# EAGLE design muxed (EAGLE 7.2.0)
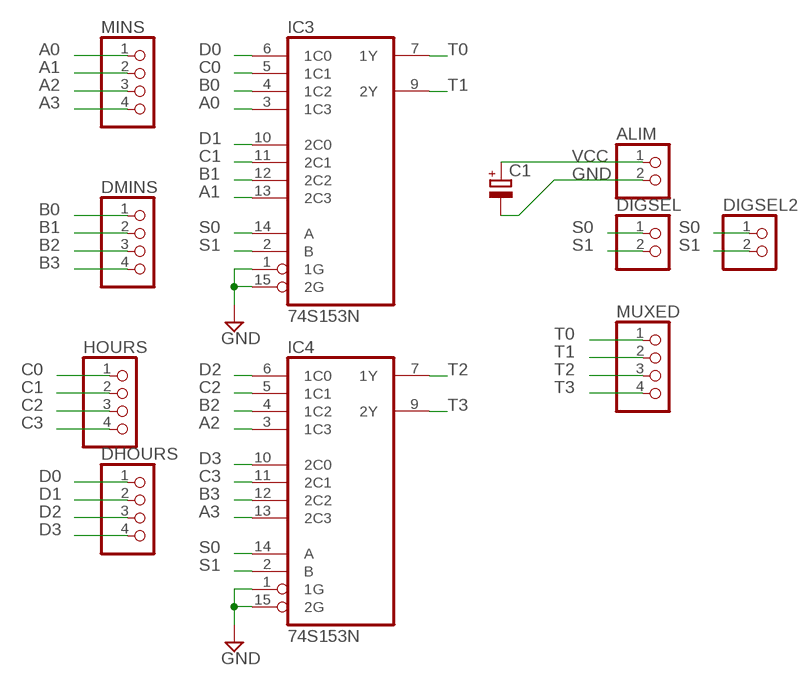
[diagram p0: schematic, sheet 1]

## Parts
ALIM  PINHD-1X2  [1X02]
C1  CPOL-EUE2-5  [E2-5]
DHOURS  PINHD-1X4  [1X04]
DIGSEL  PINHD-1X2  [1X02]
DIGSEL2  PINHD-1X2  [1X02]
DMINS  PINHD-1X4  [1X04]
HOURS  PINHD-1X4  [1X04]
IC3  74S153N  [DIL16]
IC4  74S153N  [DIL16]
MINS  PINHD-1X4  [1X04]
MUXED  PINHD-1X4  [1X04]

## Nets
A0: IC3.3(1C3) MINS.1
A1: IC3.13(2C3) MINS.2
A2: IC4.3(1C3) MINS.3
A3: IC4.13(2C3) MINS.4
B0: DMINS.1 IC3.4(1C2)
B1: DMINS.2 IC3.12(2C2)
B2: DMINS.3 IC4.4(1C2)
B3: DMINS.4 IC4.12(2C2)
C0: HOURS.1 IC3.5(1C1)
C1: HOURS.2 IC3.11(2C1)
C2: HOURS.3 IC4.5(1C1)
C3: HOURS.4 IC4.11(2C1)
D0: DHOURS.1 IC3.6(1C0)
D1: DHOURS.2 IC3.10(2C0)
D2: DHOURS.3 IC4.6(1C0)
D3: DHOURS.4 IC4.10(2C0)
GND: ALIM.2 C1.- IC3.1(1G) IC3.15(2G) IC4.1(1G) IC4.15(2G)
S0: DIGSEL2.1 DIGSEL.1 IC3.14(A) IC4.14(A)
S1: DIGSEL2.2 DIGSEL.2 IC3.2(B) IC4.2(B)
T0: IC3.7(1Y) MUXED.1
T1: IC3.9(2Y) MUXED.2
T2: IC4.7(1Y) MUXED.3
T3: IC4.9(2Y) MUXED.4
VCC: ALIM.1 C1.+

## Power pins joined to a net without a drawn wire
GND: IC3.8(GND) IC4.8(GND)
VCC: IC3.16(VCC) IC4.16(VCC)

## Library data of the parts
ALIM DIGSEL DIGSEL2 = pinhead:PINHD-1X2: PIN HEADER
C1 = rcl:CPOL-EU: POLARIZED CAPACITOR, European symbol
DHOURS DMINS HOURS MINS MUXED = pinhead:PINHD-1X4: PIN HEADER
IC3 IC4 = 74xx-us:74*153: Dual 4-line to 1-line data SELECTOR/MULTIPLEXER

## Board
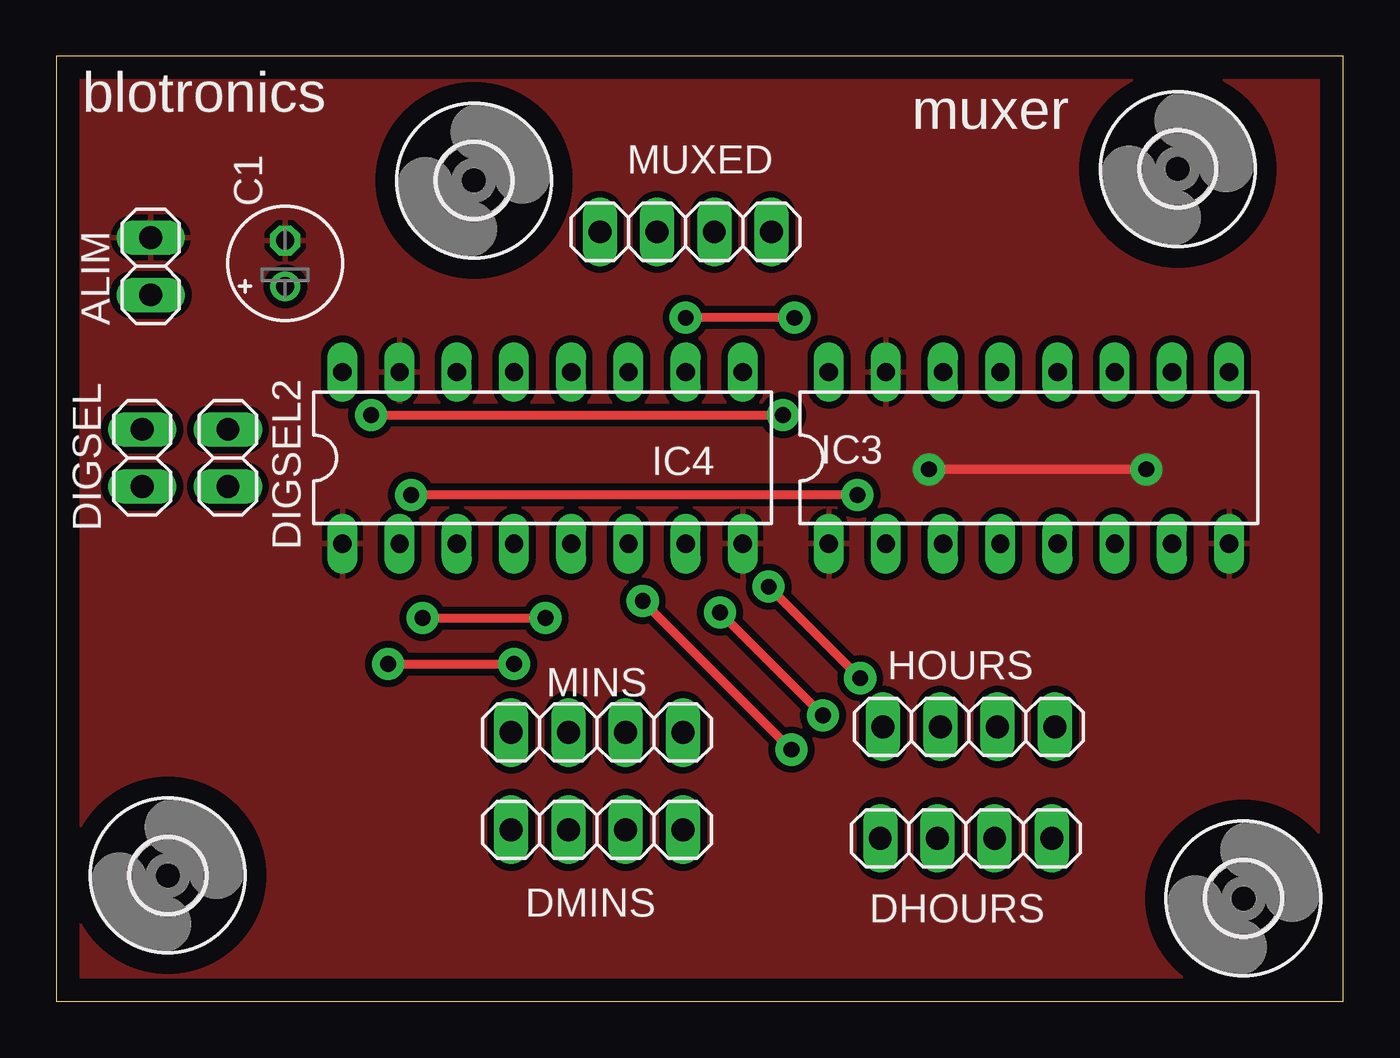
[diagram p1: board, top side]
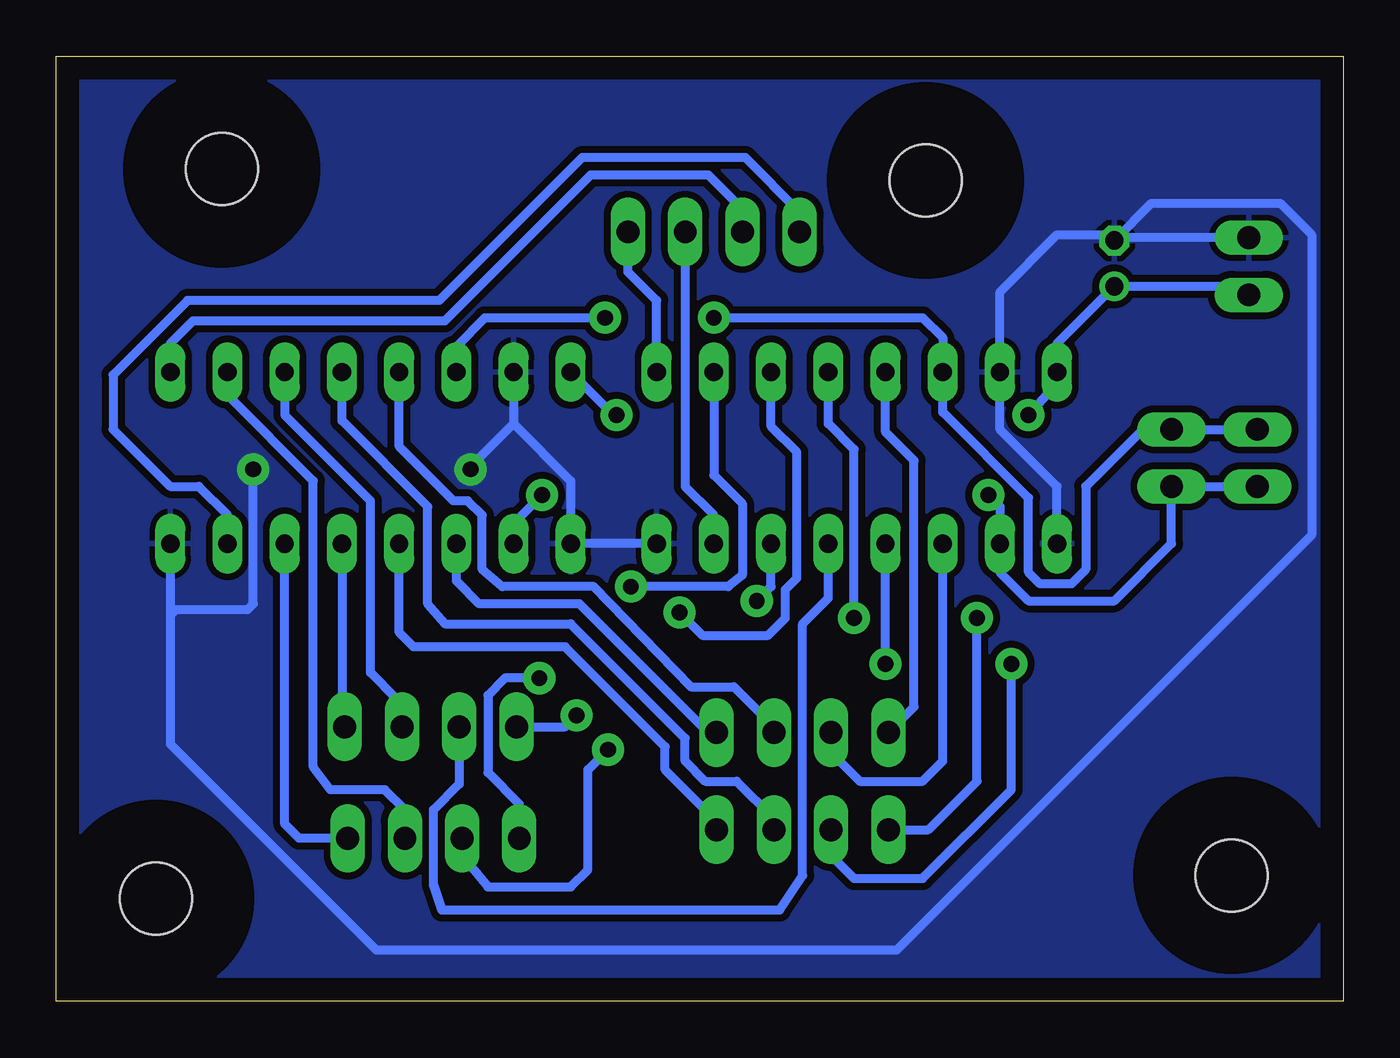
[diagram p2: board, bottom side, seen from below]

Size 57.13 x 41.96 mm. Coordinates in mm from the lower left corner, seen from the top.
Outline: 0,0 57.13,0 57.13,41.96 0,41.96 0,0
Copper layers (1*16): Top 0.035mm / dielectric 1.5mm / Bottom 0.035mm
Design rules "default": minimum track width 10mil, minimum drill 24mil, track to track 8mil, track to pad 8mil, pad to pad 8mil, via to via 8mil, smd to smd 8mil, copper to edge 40mil, drill to drill 8mil, minimum pad ring 10mil, minimum via ring 8mil, stop-mask expansion 4mil, vias tented up to drill 0mil, thermal gap 10mil

### Footprints (pad centres in the part's own frame; a part is rotated, then mirrored left to right if it is on the bottom)
1X02 = drill 1.016 long: 1 -1.27,0; 2 1.27,0
E2-5 = drill 0.813 pad 1.27: + -1.016,0 | drill 0.813 pad 1.27 octagon: - 1.016,0
1X04 = drill 1.016 long: 1 -3.81,0; 2 -1.27,0; 3 1.27,0; 4 3.81,0
DIL16 = drill 0.813 long: 1 -8.89,-3.81; 2 -6.35,-3.81; 3 -3.81,-3.81; 4 -1.27,-3.81; 5 1.27,-3.81; 6 3.81,-3.81; 7 6.35,-3.81; 8 8.89,-3.81; 9 8.89,3.81; 10 6.35,3.81; 11 3.81,3.81; 12 1.27,3.81; 13 -1.27,3.81; 14 -3.81,3.81; 15 -6.35,3.81; 16 -8.89,3.81
3,2 = hole 3.2: 0,0

### Placement (x,y rotation side)
ALIM  4.19,32.64 90 top
C1  10.16,32.77 90 top
DHOURS  40.39,7.24 180 top
DIGSEL  3.81,24.13 270 top
DIGSEL2  7.62,24.13 270 top
DMINS  24,7.62 180 top
HOURS  40.51,12.19 180 top
IC3  43.18,24.13 0 top
IC4  21.59,24.13 0 top
MINS  24,11.94 180 top
MUXED  27.94,34.16 0 top
U$1  [3,2]  18.54,36.45 0 top
U$2  [3,2]  49.78,36.96 0 top
U$3  [3,2]  4.95,5.59 0 top
U$4  [3,2]  52.7,4.57 0 top

### Tracks (layer width: path | path; a pad name or v marks a point on that pad's centre or on a via)
A0
  Bottom 0.406: IC3.3 39.37,18.67 38.35,17.65 33.91,17.65 28.19,11.94 MINS.1
A1
  Bottom 0.406: IC3.13 41.91,24.64 39.5,22.23 38.86,22.23 38.23,21.59 38.23,19.18 37.34,18.41 33.27,18.41 28.96,13.97 27.05,13.97 25.27,12.19 MINS.2
A2
  Bottom 0.406: MINS.3 22.73,11.05 21.46,9.78 18.67,9.78 17.78,10.67 IC4.3
A3
  Bottom 0.406: MINS.4 19.05,13.08 19.05,24 20.32,25.27 IC4.13
B0
  Bottom 0.406: IC3.4 41.91,16.38 41.28,15.75 34.54,15.75 30.1,11.3 30.1,10.29 27.81,8 DMINS.1
B1
  Bottom 0.406: IC3.12 44.45,25.78 40.64,21.97 40.64,17.65 39.88,16.76 34.29,16.76 29.21,11.68 29.21,10.67 28.32,9.78 26.92,9.78 25.27,8.13 DMINS.2
B2  (via drill 0.7 pad 1.42)
  Top 0.406: v14.73,14.99 v20.32,14.99
  Bottom 0.406: v20.32,14.99 IC4.4 | DMINS.3 22.73,6.48 21.72,5.46 18.67,5.46 14.73,9.4 v14.73,14.99
B3  (via drill 0.7 pad 1.42)
  Top 0.406: v16.26,17.02 v21.72,17.02
  Bottom 0.406: DMINS.4 18.41,7.62 16.26,9.78 v16.26,17.02 | v21.72,17.02 21.72,24.51 22.86,25.65 IC4.12
C0
  Bottom 0.406: IC3.5 44.45,12.32 HOURS.1
C1
  Bottom 0.406: IC3.11 46.99,26.03 43.18,22.23 43.18,14.6 42.04,13.46 41.78,13.46 HOURS.2
C2
  Bottom 0.406: HOURS.3 39.24,9.65 40.39,8.51 40.39,5.21 40,4.06 25.02,4.06 24,5.59 24,16.76 22.86,17.91 IC4.5
C3  (via drill 0.7 pad 1.42)
  Top 0.406: v34.04,12.7 v29.46,17.27
  Bottom 0.406: HOURS.4 34.54,12.19 v34.04,12.7 | IC4.11 25.4,25.53 24.26,24.38 24.26,18.8 24.77,18.29 24.77,17.02 25.53,16.26 28.45,16.26 v29.46,17.27
D0
  Bottom 0.406: DHOURS.1 46.36,7.24 46.99,7.87 IC3.6
D1
  Bottom 0.406: DHOURS.2 41.66,8.51 42.55,9.4 44.96,9.4 45.72,10.41 45.72,23.11 49.53,26.92 IC3.10
D2  (via drill 0.7 pad 1.42)
  Top 0.406: v32.64,11.18 v26.04,17.78
  Bottom 0.406: DHOURS.3 39.12,6.48 37.97,5.08 34.29,5.08 33.53,5.84 33.53,10.29 v32.64,11.18 | v26.04,17.78 25.4,18.41 IC4.6
D3  (via drill 0.7 pad 1.42)
  Top 0.406: v31.62,18.41 v35.69,14.35
  Bottom 0.406: IC4.10 27.94,23.37 26.67,22.1 26.67,18.92 27.31,18.41 v31.62,18.41 | v35.69,14.35 37.21,14.35 37.97,13.59 37.97,10.16 36.58,8.76 DHOURS.4
GND  (via drill 0.7 pad 1.42)
  Top 0.406: v48.39,23.62 v38.73,23.62
  Bottom 0.406: IC4.1 12.7,22.86 15.24,25.4 IC4.15 15.24,31.5 12.7,34.04 10.41,34.04 C1.- | IC3.15 36.83,25.65 | 36.83,25.65 34.29,23.11 IC3.1 IC4.8 | v48.39,23.62 48.39,17.65 48.64,17.4 51.82,17.4 52.07,17.15 | v38.73,23.62 38.86,23.62 36.83,25.65 | ALIM.2 10.03,33.91 C1.- | IC3.8 52.07,17.15 | C1.- 8.51,35.43 2.79,35.43 1.4,34.04 1.4,20.7 19.81,2.29 42.93,2.29 52.07,11.43 52.07,17.15
  pour Bottom (isolate 0.305): -10.03,42.42 -10.03,-0.51 69.47,-0.51 69.47,42.42
  pour Top (isolate 0.305): -4.83,44.58 -4.83,-1.27 59.56,-1.27 59.56,44.58
S0  (via drill 0.7 pad 1.42)
  Top 0.406: v32.77,30.35 v27.94,30.35
  Bottom 0.406: DIGSEL.1 DIGSEL2.1 8.89,25.4 11.43,22.86 11.43,19.18 12.07,18.54 13.46,18.54 13.97,19.05 13.97,22.35 17.78,26.16 IC4.14 17.78,29.46 18.67,30.35 v27.94,30.35 | IC3.14 39.37,29.08 38.1,30.35 v32.77,30.35
S1  (via drill 0.7 pad 1.42)
  Top 0.406: v35.56,22.48 v15.75,22.48
  Bottom 0.406: DIGSEL.2 DIGSEL2.2 7.62,20.32 10.16,17.78 13.97,17.78 15.24,19.05 IC4.2 15.24,21.97 v15.75,22.48 | IC3.2 36.83,21.21 v35.56,22.48
T0
  Bottom 0.406: IC3.7 49.53,21.59 50.8,22.86 52.07,22.86 54.61,25.4 54.61,27.81 51.31,31.12 40.13,31.12 33.78,37.46 26.54,37.46 24.13,35.05 MUXED.1
T1
  Bottom 0.406: IC3.9 52.07,29.21 51.05,30.23 39.88,30.23 33.4,36.7 28.19,36.7 26.67,35.18 MUXED.2
T2
  Bottom 0.406: MUXED.3 29.21,22.86 27.94,21.59 IC4.7
T3
  Bottom 0.406: IC4.9 30.48,31.12 31.75,32.38 MUXED.4
VCC  (via drill 0.7 pad 1.42)
  Top 0.406: v13.97,26.03 v32.26,26.03
  Bottom 0.406: v13.97,26.03 12.7,27.43 IC4.16 12.7,29.21 C1.+ 5.08,31.75 4.7,31.37 ALIM.1 | v32.26,26.03 32.39,26.03 IC3.16

### Text on the board
tPlace: blotronics | muxer